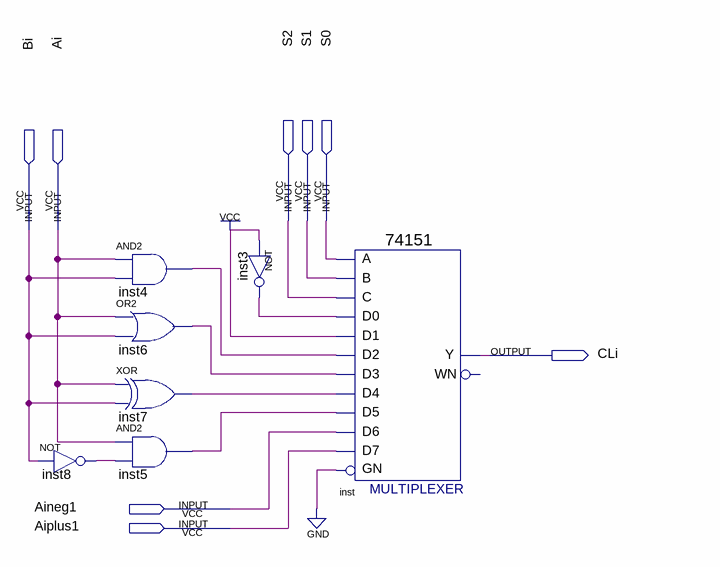
[diagram p0: schematic sheet]
// Quartus schematic logiccircuit1bit.bdf as structural Verilog: 7 symbols, 8 pins
module logiccircuit1bit (
  input  S2,
  input  S1,
  input  S0,
  input  Bi,
  input  Ai,
  input  Aineg1,
  input  Aiplus1,
  output CLi
);

  wire inst3_out, inst4_out, inst5_out, inst6_out, inst7_out, inst8_out;

  not inst8 (inst8_out, Bi);
  and inst4 (inst4_out, Ai, Bi);
  or inst6 (inst6_out, Ai, Bi);
  xor inst7 (inst7_out, Ai, Bi);
  and inst5 (inst5_out, Ai, inst8_out);
  not inst3 (inst3_out, 1'b1);
  \74151  inst (
    .GN(1'b0), .C(S2), .B(S1), .A(S0), .D5(inst5_out), .D0(inst3_out), .D1(1'b1), .D4(inst7_out),
    .D3(inst6_out), .D2(inst4_out), .D6(Aineg1), .D7(Aiplus1), .Y(CLi));  // open: WN
endmodule
